# EAGLE design input_board_proto_rev1 (EAGLE 7.4.0)
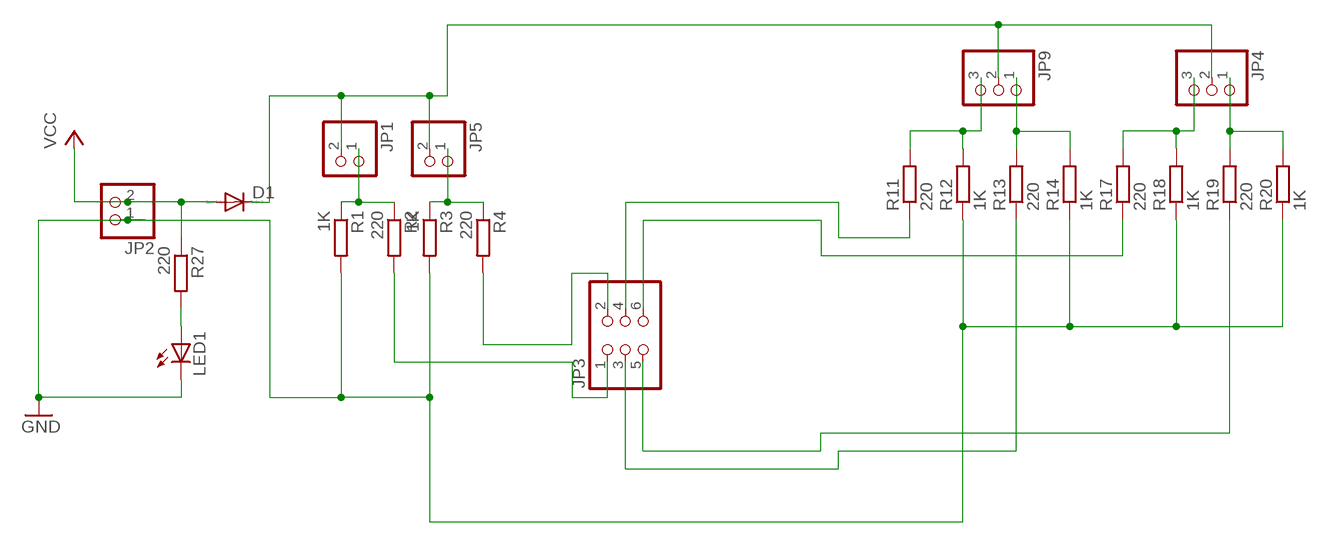
[diagram p0: schematic, sheet 1]

## Parts
D1  DIODE-C1702-05  [C1702-05]
JP1  PINHD-1X2  [1X02]
JP2  PINHD-1X2  [1X02]
JP3  PINHD-2X3  [2X03]
JP4  PINHD-1X3  [1X03]
JP5  PINHD-1X2  [1X02]
JP9  PINHD-1X3  [1X03]
LED1  LED3MM  [LED3MM]
R1  1K  R-EU_0204/2V  [0204V]
R2  220  R-EU_0204/2V  [0204V]
R3  1K  R-EU_0204/2V  [0204V]
R4  220  R-EU_0204/2V  [0204V]
R11  220  R-EU_0204/2V  [0204V]
R12  1K  R-EU_0204/2V  [0204V]
R13  220  R-EU_0204/2V  [0204V]
R14  1K  R-EU_0204/2V  [0204V]
R17  220  R-EU_0204/2V  [0204V]
R18  1K  R-EU_0204/2V  [0204V]
R19  220  R-EU_0204/2V  [0204V]
R20  1K  R-EU_0204/2V  [0204V]
R27  220  R-EU_0204/2V  [0204V]

## Nets
GND: JP2.1 LED1.K(C) R1.2 R3.2 R12.1 R14.1 R18.1 R20.1
N$1: JP1.1 R1.1 R2.1
N$4: JP5.1 R3.1 R4.1
N$8: JP3.1 R2.2
N$9: JP3.2 R4.2
N$14: JP9.3 R11.2 R12.2
N$15: JP9.1 R13.2 R14.2
N$17: JP4.3 R17.2 R18.2
N$18: JP4.1 R19.2 R20.2
N$26: JP3.6 R17.1
N$27: JP3.4 R11.1
N$31: JP3.5 R19.1
N$32: JP3.3 R13.1
N$33: LED1.A R27.2
N$35: D1.C JP1.2 JP4.2 JP5.2 JP9.2
VCC: D1.A JP2.2 R27.1

## Library data of the parts
D1 = diode:DIODE-: DIODE
JP1 JP2 JP5 = pinhead:PINHD-1X2: PIN HEADER
JP3 = pinhead:PINHD-2X3: PIN HEADER
JP4 JP9 = pinhead:PINHD-1X3: PIN HEADER
LED1 = led:LED: LED OSRAM: - CHIPLED LG R971, LG N971, LY N971, LG Q971, LY Q971, LO R971, LY R971 LH N974, LH R974 LS Q976, LO Q976, LY Q976 LO Q996 - Hyper CHIPLED LW Q18S LB Q993, LB Q99A, LB R99A - SideLED LS A670, LO A670, LY A670, LG A670, LP A670 LB A673, LV A673, LT A673, LW A673 LH A674 LY A675 LS A676, LA A676, LO A676, LY A676, LW A676 LS A679, LY A679, LG A679 - Hyper Micro SIDELED® LS Y876, LA Y876, LO Y876, LY Y876 LT Y87S - SmartLED LW L88C, LW L88S LB L89C, LB L89S, LG L890 LS L89K, LO L89K, LY L89K LS L896, LA L896, LO L896, LY L896 - TOPLED LS T670, LO T670, LY T670, LG T670, LP T670 LSG T670, LSP T670, LSY T670, LOP T670, LYG T670 LG T671, LOG T671, LSG T671 LB T673, LV T673, LT T673, LW T673 LH T674 LS T676, LA T676, LO T676, LY T676, LB T676, LH T676, LSB T676, LW T676 LB T67C, LV T67C, LT T67C, LS T67K, LO T67K, LY T67K, LW E67C LS E67B, LA E67B, LO E67B, LY E67B, LB E67C, LV E67C, LT E67C LW T67C LS T679, LY T679, LG T679 LS T770, LO T770, LY T770, LG T770, LP T770 LB T773, LV T773, LT T773, LW T773 LH T774 LS E675, LA E675, LY E675, LS T675 LS T776, LA T776, LO T776, LY T776, LB T776 LHGB T686 LT T68C, LB T68C - Hyper Mini TOPLED® LB M676 - Mini TOPLED Santana® LG M470 LS M47K, LO M47K, LY M47K Source: http://www.osram.convergy.de LUXEON: - LUMILED® LXK2-PW12-R00, LXK2-PW12-S00, LXK2-PW14-U00, LXK2-PW14-V00 LXK2-PM12-R00, LXK2-PM12-S00, LXK2-PM14-U00 LXK2-PE12-Q00, LXK2-PE12-R00, LXK2-PE12-S00, LXK2-PE14-T00, LXK2-PE14-U00 LXK2-PB12-K00, LXK2-PB12-L00, LXK2-PB12-M00, LXK2-PB14-N00, LXK2-PB14-P00, LXK2-PB14-Q00 LXK2-PR12-L00, LXK2-PR12-M00, LXK2-PR14-Q00, LXK2-PR14-R00 LXK2-PD12-Q00, LXK2-PD12-R00, LXK2-PD12-S00 LXK2-PH12-R00, LXK2-PH12-S00 LXK2-PL12-P00, LXK2-PL12-Q00, LXK2-PL12-R00 Source: www.luxeon.com KINGBRIGHT: KA-3528ASYC Source: www.kingbright.com
R1-R4 R11-R14 R17-R20 R27 = resistor:R-EU_: RESISTOR, European symbol

## Board
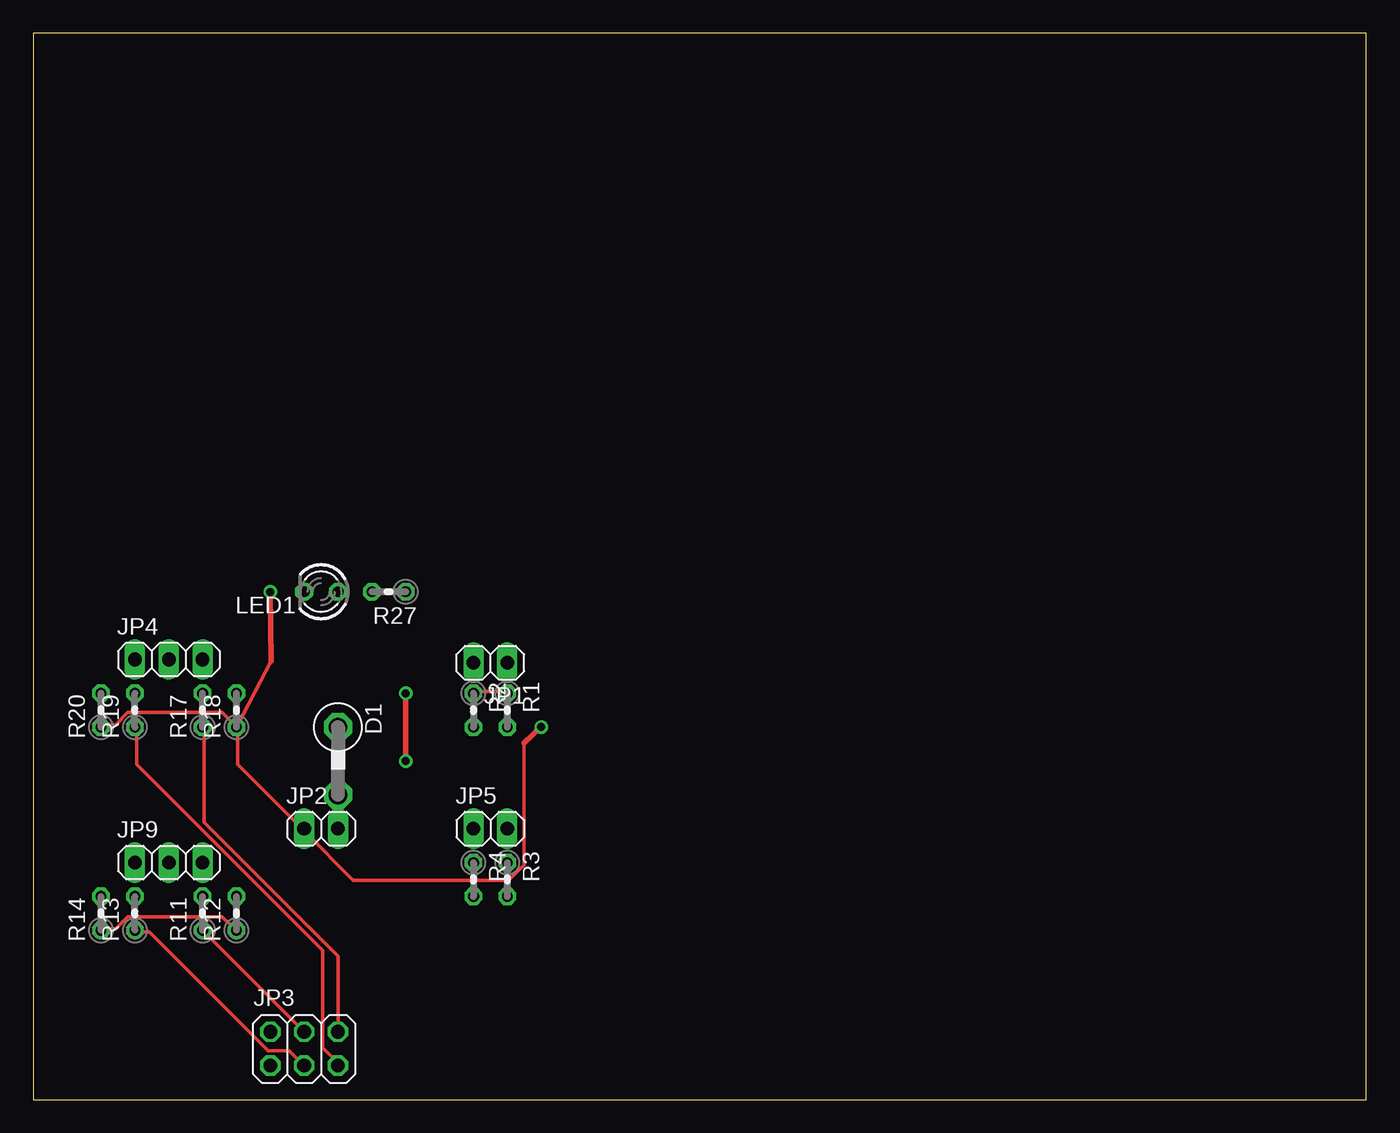
[diagram p1: board, top side]
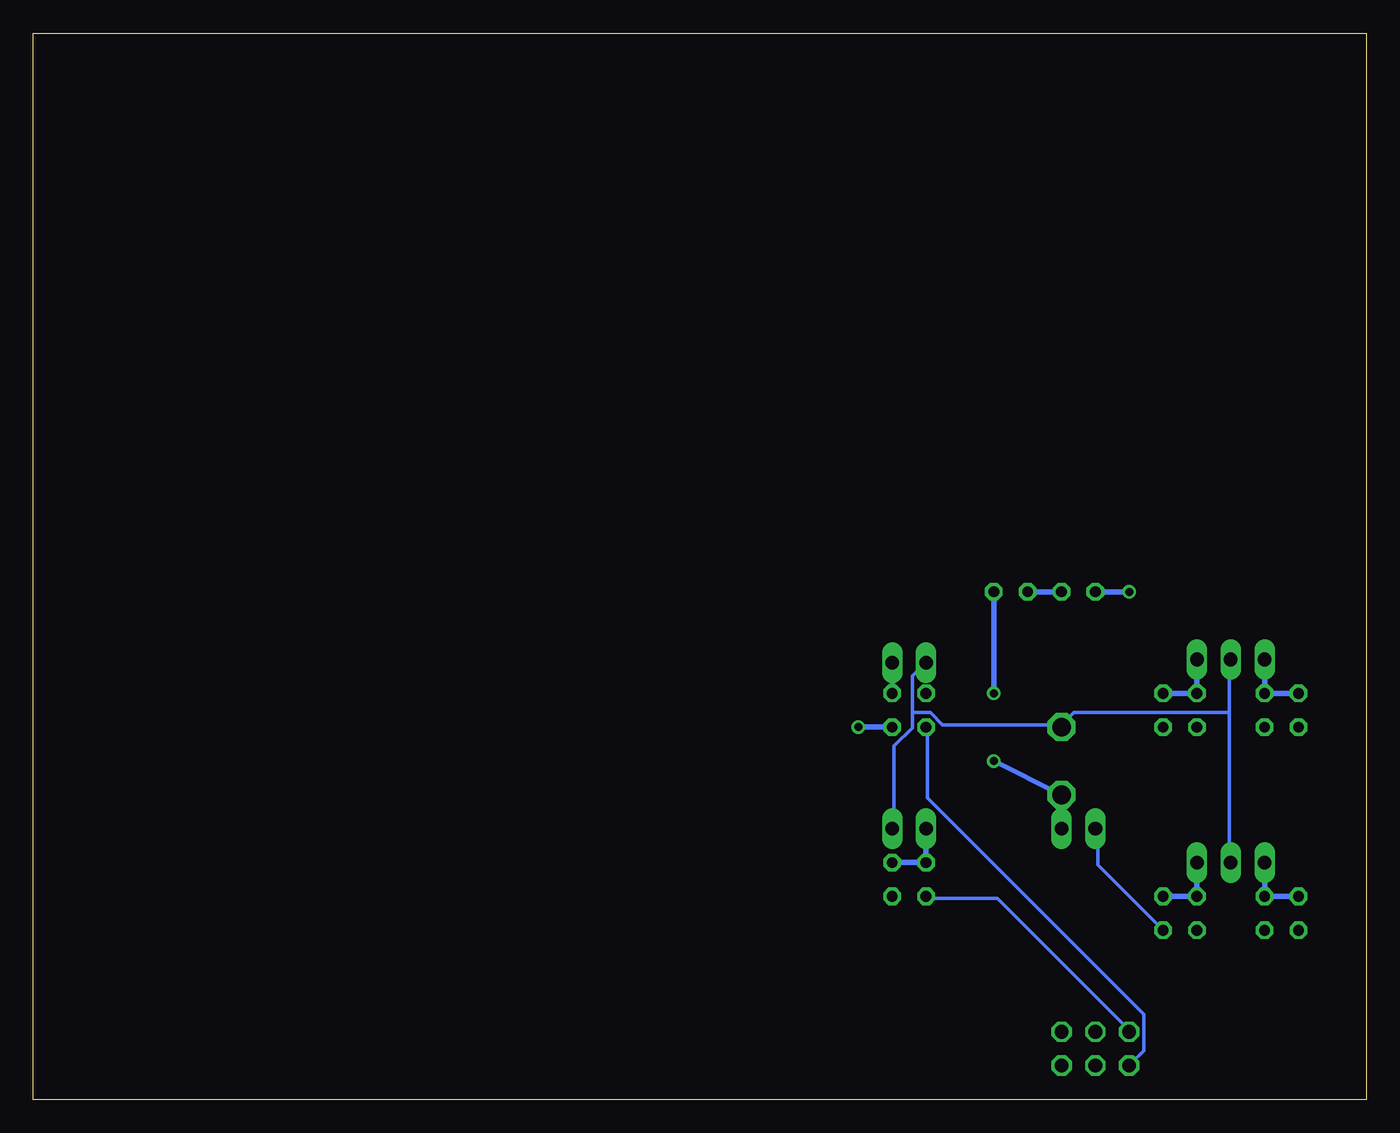
[diagram p2: board, bottom side, seen from below]

Size 100 x 80 mm. Coordinates in mm from the lower left corner, seen from the top.
Outline: 0,0 100,0 100,80 0,80 0,0
Copper layers (1*16): Top 0.035mm / dielectric 1.5mm / Bottom 0.035mm
Design rules "default": minimum track width 10mil, minimum drill 24mil, track to track 8mil, track to pad 8mil, pad to pad 8mil, via to via 8mil, smd to smd 8mil, copper to edge 40mil, drill to drill 8mil, minimum pad ring 10mil, minimum via ring 8mil, stop-mask expansion 4mil, vias tented up to drill 0mil, thermal gap 10mil

### Footprints (pad centres in the part's own frame; a part is rotated, then mirrored left to right if it is on the bottom)
C1702-05 = drill 1.397 octagon: A 2.54,0; C -2.54,0
1X02 = drill 1.016 long: 1 -1.27,0; 2 1.27,0
2X03 = drill 1.016 octagon: 1 -2.54,-1.27; 2 -2.54,1.27; 3 0,-1.27; 4 0,1.27; 5 2.54,-1.27; 6 2.54,1.27
1X03 = drill 1.016 long: 1 -2.54,0; 2 0,0; 3 2.54,0
LED3MM = drill 0.813 octagon: A -1.27,0; K 1.27,0
0204V = drill 0.813 octagon: 1 -1.27,0; 2 1.27,0

### Placement (x,y rotation side)
D1  22.86,25.4 270 top
JP1  34.29,32.77 180 top
JP2  21.59,20.32 0 top
JP3  20.32,3.81 0 top
JP4  10.16,33.02 0 top
JP5  34.29,20.32 0 top
JP9  10.16,17.78 0 top
LED1  21.59,38.1 180 top
R1  35.56,29.21 270 top
R2  33.02,29.21 270 top
R3  35.56,16.51 270 top
R4  33.02,16.51 270 top
R11  12.7,13.97 90 top
R12  15.24,13.97 90 top
R13  7.62,13.97 90 top
R14  5.08,13.97 90 top
R17  12.7,29.21 90 top
R18  15.24,29.21 90 top
R19  7.62,29.21 90 top
R20  5.08,29.21 90 top
R27  26.67,38.1 180 top

### Tracks (layer width: path | path; a pad name or v marks a point on that pad's centre or on a via)
GND  (via drill 0.6)
  Top 0.254: R20.1 5.26,28.12 6.17,28.12 7.09,29.03 14.17,29.03 15.09,28.12 R18.1 | 17.83,32.92 15.32,28.12 R18.1 | 35.66,16.46 35.66,15.32 R3.2 | 35.66,16.46 36.8,17.6 36.8,26.75 | R14.1 5.26,12.8 6.17,12.8 7.09,13.72 14.17,13.72 15.09,12.8 R12.1 | 35.66,16.46 24,16.46 20.34,20.12 JP2.1 20.12,20.34 15.32,25.15 15.32,27.89 R18.1
  Top 0.406: v17.78,38.1 17.83,32.92 | v38.1,27.94 36.8,26.75
  Bottom 0.254: JP2.1 20.12,20.12 20.12,17.6 15.32,12.8 R12.1
  Bottom 0.406: LED1.K v17.78,38.1 | R1.2 v38.1,27.94
N$1
  Top 0.254: R2.1 33.15,30.63 35.43,30.63 R1.1 35.66,30.63
  Bottom 0.406: 35.56,33.02 JP1.1 R1.1
N$2  (via drill 0.6)
  other vias: 27.94,25.4
N$3  (via drill 0.6)
  other vias: 27.94,30.48
N$4
  Bottom 0.406: JP5.1 R4.1 R3.1
N$5  (via drill 0.6)
  other vias: 17.78,38.1
N$6  (via drill 0.6)
  other vias: 38.1,27.94
N$8
  Bottom 0.254: R2.2 32.92,27.89 32.92,22.63 16.69,6.4 16.69,3.66 17.6,2.74 JP3.1
N$9
  Bottom 0.254: R4.2 32.92,15.09 27.66,15.09 17.83,5.26 JP3.2
N$14
  Bottom 0.406: JP9.3 R11.2 R12.2
N$15
  Bottom 0.406: JP9.1 R13.2 R14.2
N$17
  Bottom 0.406: JP4.3 R17.2 R18.2
N$18
  Bottom 0.406: JP4.1 R19.2 R20.2
N$26
  Top 0.254: JP3.6 22.86,10.74 12.8,20.8 12.8,27.89 R17.1
N$27
  Top 0.254: R11.1 12.8,12.57 20.12,5.26 JP3.4
N$31
  Top 0.254: R19.1 7.77,27.89 7.77,25.15 21.72,11.2 21.72,3.89 22.86,2.74 JP3.5
N$32
  Top 0.254: JP3.3 19.2,3.66 17.6,3.66 8.69,12.57 7.77,12.57 R13.1
N$33
  Bottom 0.406: R27.2 LED1.A
N$35
  Bottom 0.254: 10.29,29.03 10.29,32.92 JP4.2 | 10.29,29.03 10.29,17.83 JP9.2 | 34.06,29.03 34.06,31.77 33.15,32.69 JP1.2 | 34.06,29.03 34.06,27.89 35.43,26.52 35.43,20.34 JP5.2 | 22.86,28.12 31.77,28.12 32.69,29.03 34.06,29.03 | 10.29,29.03 21.95,29.03 22.86,28.12 | 22.86,28.12 D1.C
VCC  (via drill 0.6)
  Top 0.406: v27.94,25.4 v27.94,30.48
  Bottom 0.406: JP2.2 D1.A v27.94,25.4 | v27.94,30.48 R27.1